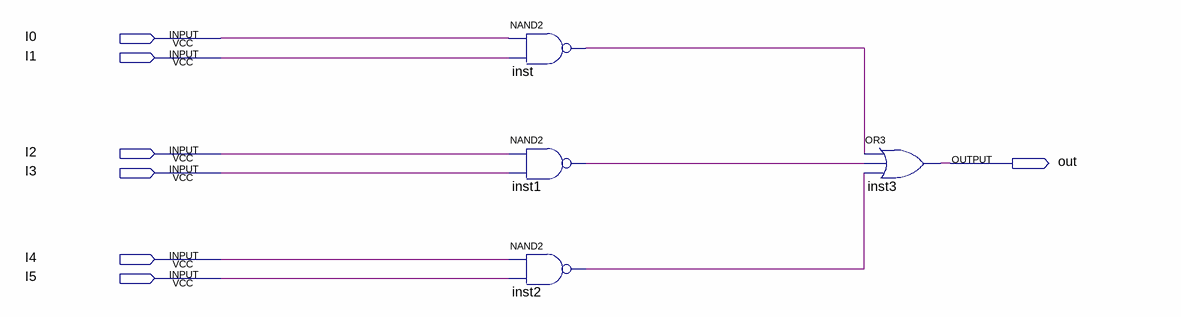
[diagram p0: schematic sheet]
// Quartus schematic Lab1.bdf as structural Verilog: 4 symbols, 7 pins
module Lab1 (
  input  I0,
  input  I1,
  input  I2,
  input  I3,
  input  I4,
  input  I5,
  output out
);

  wire inst1_out, inst2_out, inst_out;

  nand inst (inst_out, I0, I1);
  nand inst1 (inst1_out, I2, I3);
  nand inst2 (inst2_out, I4, I5);
  or inst3 (out, inst_out, inst1_out, inst2_out);
endmodule
